# Altium schematic sheet Power Management.SchDoc
size A4; SheetNumber: 4; SheetTotal: 4
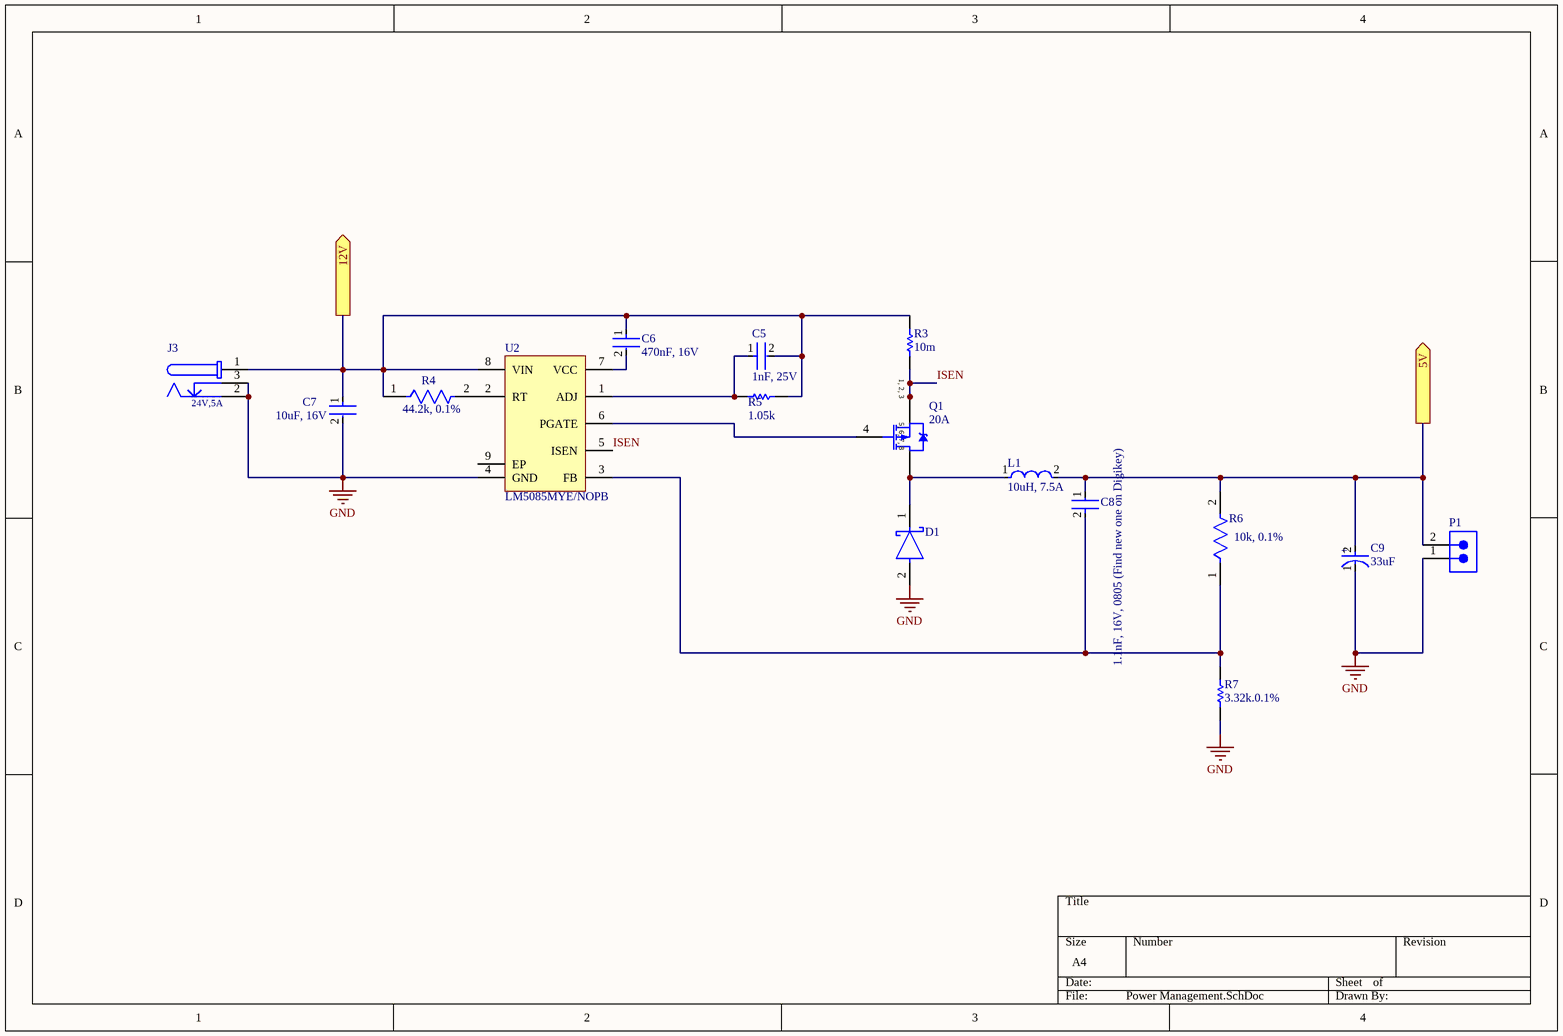
[diagram p0: Power Management.SchDoc]

## Parts
C5  1nF, 25V  [FP-C0805C-DN-MFG]
C6  470nF, 16V  [FP-0805-L_2_01_0_2-W_1_25-IPC_B]
C7  10uF, 16V  [FP-C2012-125-0_2-MFG]
C8  1.1nF, 16V, 0805 (Find new one on Digikey)  [FP-GRM216-0_1-MFG]
C9  33uF  [FP-TAJB-MFG]
D1  (no value)  [FP-95402-MFG]
J3  24V,5A  [694106301002]
L1  10uH, 7.5A  [FP-IHLP-4040DZ-FP_3_124x3-MFG]
P1  TSW-102-26-G-S  [SMTC-TSW-102-26-XX-S]  (value not drawn)
Q1  20A  [ONSC-SOIC-8-751-07_V]
R3  10m  [RESC2013X75X55NL20T20]
R4  44.2k, 0.1%  [FP-RT0805-MFG]
R5  1.05k  [RESC2013X70X40NL20T20]
R6  10k, 0.1%  [FP-MCU0805-IPC_C]
R7  3.32k.0.1%  [RESC2013X55X40NL15T20]
U2  LM5085MYE/NOPB  [DGN0008A_N]

## Ports
5V (out), 12V (out)

## Nets
GND: C7.2 C9.1(C) D1.2(A) J3.2 J3.3 P1.1 R7.1 U2.4(GND)
5V: C8.1 C9.2(A) L1.2 P1.2 R6.2 ; port 5V
12V: C5.2 C6.1 C7.1 J3.1 R3.2 R4.1 R5.2 U2.8(VIN) ; port 12V
ISEN: Q1.1(S) Q1.2(S) Q1.3(S) R3.1 U2.5(ISEN)
NetC5_1: C5.1 R5.1 U2.1(ADJ)
NetC6_2: C6.2 U2.7(VCC)
NetC8_2: C8.2 R6.1 R7.2 U2.3(FB)
NetD1_1: D1.1(C) L1.1 Q1.5(D) Q1.6(D) Q1.7(D) Q1.8(D)
NetQ1_4: Q1.4(G) U2.6(PGATE)
NetR4_2: R4.2 U2.2(RT)

Not connected (* = marked no-connect by the designer): U2 9(EP)

## Notes on the sheet
- (in symbol CMP-1058-00697-1) 1, 2, 3; 5, 6, 7, 8
- (in symbol CMP-04424-000306-1) +

## Library data of the parts
C5 = CMP-2007-01131-2: CAP CER 1000PF 25V X7R 0805; Manufacturer: KEMET; Manufacturer Part Number: C0805C102K3RACTU; Material: Ceramic; Description: C0805 1,000 pF X7R 30ppm/°C 10.00% 25 V; Tolerance: 0.1; Value: 1,000 pF; Temperature Coefficient: 30ppm/°C; RoHS: TRUE; Ipc Land Pattern Name: CAPC200125X78; Digikey Description: CAP CER 1000PF 25V X7R 0805; ComponentLink2URL: https://content.kemet.com/datasheets/KEM_C1003_C0G_SMD.pdf; Octopart: https://octopart.com/c0805c102k3ractu-kemet-16646211; Mouser Description: Cap Ceramic 0.001uF 25V X7R 10% SMD 0805 125°C Paper T/R; Temperature Range Low: -55°C; Temperature Characteristic: X7R; Package: C0805C-DN; ComponentLink2Description: Datasheet; Lead Free: Yes; Temperature Range High: +125°C; Voltage Rating: 25 V; Automotive: No; Height: 0.88mm; Capacitance: 1,000 pF; Device Class L3: Ceramic Capacitors; Device Class L1: Passive Components; Category: Cap; Device Class L2: Capacitors; Temperature: -55°C to +125°C
C6 = CMP-2007-04653-2: General Purpose Ceramic Capacitor, 0805, 470nF, 10%, X7R, 15%, 16V; Dissipation Factor: 3.5%; Insulation Resistance: 100GR; Thickness: 0.055inch; Max Operating Temperature: 125°C; Termination: SMD/SMT; Voltage: 16V; Dielectric: X7R; Lead Free: Lead Free; Construction: Flat; Case Code (Metric): 2012; Min Operating Temperature: -55°C; Size: 1.4mm; Case Code (Imperial): 0805; RoHS Compliant: Yes; Case/Package: 0805; Capacitance: 470nF; Tolerance: 10%; Number of Pins: 2; Voltage Rating (DC): 16V; Depth: 1.25mm; Width: 1.25mm; Contact Plating: Tin; Package Quantity: 1; Voltage Rating: 16V; Height: 1.4mm; Packaging: Tape and Reel; Length: 2.01mm; REACH SVHC: No SVHC; Mount: Surface Mount; Series: -; Radiation Hardening: No
C7 = CMP-08246-003655-1: Multilayer Ceramic Capacitors 10μF ±10% 16V X6S SMD 0805; Contact Plating: Tin; Height: 1.25mm; Thickness: 0.057inch; Case Code (Metric): 2012; Dielectric Material: Ceramic; Tolerance: 10%; Depth: 1.25mm; Length: 2mm; Lead Free: Lead Free; RoHS Compliant: Yes; Case/Package: 0805; REACH SVHC: No SVHC; Capacitance: 10uF; Construction: Flat; Voltage Rating: 16V; Max Operating Temperature: 105°C; Series: C; Width: 0.049inch; Voltage Rating (DC): 16V; Packaging: Tape and Reel; Package Quantity: 1; Min Operating Temperature: -55°C; Mount: Surface Mount; Dielectric: X6S; Case Code (Imperial): 0805
C8 = CMP-2007-00909-2: Chip Multilayer Ceramic Capacitors for General Purpose, 0805, 1100pF, C0G, 30ppm/°C, 5%, 100V; Case Code (Imperial): 0805; Tolerance: 5%; Weight: 0.000194oz; Voltage Rating (DC): 100V; Construction: Flat; Case Code (Metric): 2012; Max Operating Temperature: 125°C; Width: 0.049inch; Min Operating Temperature: -55°C; RoHS Compliant: Yes; Voltage Rating: 100V; Case/Package: 0805; Height: 0.6mm; Thickness: 0.028inch; Packaging: Tape and Reel; Series: GRM; Mount: Surface Mount; Capacitance: 1.1nF; Radiation Hardening: No; Termination: SMD/SMT; Length: 2mm; Package Quantity: 4000; Depth: 1.25mm; Dielectric: C0G
C9 = CMP-04424-000306-1: 33uF 6.3V  ±10% 2.2Ω 1210  SMD Tantalum Capacitor; Tolerance: 20%; ESR (Equivalent Series Resistance): 2.2R; Dissipation Factor: 6%; Leakage Current: 2.1uA; Polarity: Polar; Voltage: 10V; Lead Free: Lead Free; Min Operating Temperature: -55°C; REACH SVHC: No SVHC; Lead Pitch: 1.4mm; Features: General Purpose; Case Code (Imperial): 1210; Package Quantity: 1; Case/Package: 1210; Radiation Hardening: No; RoHS Compliant: Yes; Dielectric Material: Tantalum; Height - Seated (Max): 0.083inch; Length: 3.5mm; Mount: Surface Mount; Construction: Flat; Width: 2.8mm; Capacitance: 33uF; Case Code (Metric): 3528; Number of Pins: 2; Depth: 2.8mm; Series: TAJ; Voltage Rating (DC): 6.3V; Height: 1.9mm; Packaging: Tape and Reel; Voltage Rating: 6.3V; Max Operating Temperature: 125°C; Termination: SMD/SMT
D1 = CMP-02539-000012-1: DIODE SCHOTTKY 40V 3A DO214AB; Manufacturer: Vishay; Manufacturer Part Number: SS34-E3/57T; Description: Diode Schottky 40V 3A Surface Mount DO-214AB (SMC); Max Junction Temp: +150°C; Peak Reverse Current: 0.5mA; Max Surge Forward Current: 100A; Standoff Height: 0mm; ComponentLink2Description: Datasheet; Device Class L3: Schottky Diodes; Height: 2.62mm; Max Repetitive Reverse Voltage: 40V; Lead Free: Yes; Package: 95402; Temperature Range High: +150°C; ComponentLink2URL: http://www.vishay.com/docs/88751/ss32.pdf; Temperature: -55°C to +150°C; Footprint Url: http://www.vishay.com/docs/95402/smc.pdf; Automotive: No; Forward Current: 3A; Category: Diode; RoHS: TRUE; Device Class L2: Diodes; Mouser Description: Schottky Diodes & Rectifiers 3.0 Amp 40 Volt; Octopart: https://octopart.com/ss34-e3%2F57t-vishay-39552907; Temperature Range Low: -55°C; Device Class L1: Discrete Semiconductors; Digikey Description: DIODE SCHOTTKY 40V 3A DO214AB
J3 = CMP-1502-00188-1: DC Power Jack Connector WR-DC, Male, Right Angled, THT, 5 A, 24 V; Manufacturer: Wurth Elektronik; Plug Inner Diameter: 2.05mm; Opening Diameter: 6.4mm; Plug Outer Diameter: 5.5mm; Datasheet URL: http://katalog.we-online.de/em/datasheet/6941xx301002.pdf; Packaging: Bag; Manufacturer URL: http://www.we-online.de; Part Number: 694106301002; Rated Current: 5A; Gender: Male; Publisher: WurthElektronik; Operating Temperature: -40to85degC; Mounting Technology: THT; Package Reference: 694106301002; Working Voltage: 24V; Orientation: RightAngled
L1 = CMP-02424-000252-1: Commercial Inductors, Low DCR Series 10uH 7.5A 30.5mΩ 20%; DC Resistance (DCR): 30.5mR; Core Material: Metal; Test Frequency: 100kHz; Self Resonant Frequency: 1MHz; Saturation Current: 7.1A; Shielding: Shielded; Height - Seated (Max): 0.157inch; Height: 4mm; Number of Pins: 2; Current Rating: 7.5A; Packaging: Tape and Reel; Tolerance: 20%; Case/Package: 4040; Depth: 10.3mm; Radiation Hardening: No; Military Standard: Not; Min Operating Temperature: -55°C; Max Operating Temperature: 125°C; RMS Current (Irms): 7.5A; Mount: Surface Mount; Inductance: 10uH; Width: 10.3mm; Max DC Current: 7.1A; Termination: SMD/SMT; Package Quantity: 500; Contact Plating: Tin; Lead Free: Lead Free; Inductance Tolerance: 20%; Length: 10.92mm
P1 = CMP-1024-00327-1: 0.025" SQ Post Header, Through-hole, Vertical, -55 to 125 degC, 2.54 mm Pitch, 2-Pin, Male, RoHS; Manufacturer: Samtec; Pitch: 2.54 mm; Orientation: Vertical; ComponentLink3Description: Package Specification; PackageReference: TSW-102-26-XX-S; Mounting Technology: Through-hole; ComponentLink2Description: Datasheet; ComponentLink1URL: http://www.samtec.com; DatasheetVersion: F-214; ComponentLink1Description: Manufacturer URL; RoHS: True; ComponentLink2URL: http://www.samtec.com/documents/webfiles/pdf/TSW_TH.PDF; PartNumber: TSW-102-26-G-S; ComponentLink3URL: http://www.samtec.com/documents/webfiles/cpdf/TSW-XXX-XX-XXX-X-XX-XXX-MKT.pdf; PackageDescription: .025[0.64] SQ. Post Terminal Strip Assembly; PackageVersion: DM, 8/1988; Temperature Range: -55 to 125 degC
Q1 = CMP-1058-00697-1: Power MOSFET, -10 A, -20 V, Single P-Channel Enhancement-Mode, 8-Pin SOIC, Pb-Free, Tape and Reel; PartNumber: NTMS10P02R2G; Manufacturer: On Semiconductor; VGS Max (V): 12; Qrr Typ (nC): 75; V(BR)DSS Min (V): 20; Crss Typ (pF): 475; Ciss Typ (pF): 3100; Channel Polarity: P Channel; Coss Typ (pF): 1100; VGS(th) Max (V): 1.2; PackageReference: SOIC-8-751-07; Configuration: Single; ComponentLink1URL: http://www.onsemi.com/; RoHS: Pb-Free; PackageDescription: 8-Pin Small Outline Integrated Circuit, Body 4.9 x 3.9 mm, Pitch 1.27 mm; Mounting Technology: Surface Mount; Package Type: SOIC-8; ComponentLink2Description: Datasheet; Packing: Tape and Reel; ComponentLink3URL: http://www.onsemi.com/pub_link/Collateral/751-07.PDF; ComponentLink3Description: Package Specification; DatasheetVersion: Rev. 3; ComponentLink1Description: Manufacturer URL; ComponentLink2URL: http://www.onsemi.cn/pub_link/Collateral/NTMS10P02R2-D.PDF; PackageVersion: Rev. AK, 02/2011
R3 = CMP-2001-04363-1: Part Number: ERJ-6BWFR010V; Manufacturer: Panasonic
R4 = CMP-03412-006606-1: RES SMD 44.2K OHM 0.1% 1/8W 0805; Manufacturer Part Number: RT0805BRD0744K2L; Manufacturer: Yageo; Description: RT0805 44.2KΩ 0.125W 25 ppm/°C 0.25%; Temperature Coefficient: 25 ppm/°C; Voltage Rating: 150V; Resistance: 44.2KΩ; Power Rating: 0.125W; Tolerance: 0.0025; Value: 44.2KΩ; Footprint Url: http://www.yageo.com/exep/pages/download/literatures/PYu-R_Mount_10.pdf; Composition: Thin Film; Octopart: https://octopart.com/rt0805brd0744k2l-yageo-1480106; Series: RT; ComponentLink2Description: Datasheet; Automotive: No; Temperature: -55°C to +155°C; Device Class L2: Resistors; Package: RT0805; Height: 0.6mm; Ipc Land Pattern Name: RESC200125X50; Digikey Description: RES SMD 44.2K OHM 0.1% 1/8W 0805; Lead Free: Yes; Mouser Description: Thin Film Resistors - SMD 1/8W 44.2K ohm .1% 25ppm; ComponentLink2URL: http://www.yageo.com/documents/recent/PYu-RT_1-to-0.01_RoHS_L_9.pdf; RoHS: TRUE; Device Class L3: Chip SMD Resistors; Temperature Range Low: -55°C; Device Class L1: Passive Components; Category: Res; Temperature Range High: +155°C
R5 = CMP-2001-04384-1: Manufacturer: Panasonic; Part Number: ERJ-6ENF1051V
R6 = CMP-02407-001182-1: RES 1.05K OHM 0.5% 1/5W 0805; Voltage Rating (DC): 150V; Resistance: 10kR; Power Rating: 50mW; Temperature Coefficient: 25ppm/°C; Packaging: Tape and Reel; Contact Plating: Tin; Case Code (Imperial): 0805; Mount: Surface Mount; Width: 1.25mm; Lead Free: Lead Free; Case/Package: 0805; Length: 2mm; Voltage Rating: 150V; Composition: Thin Film; REACH SVHC: No SVHC; Military Standard: Not; Max Operating Temperature: 125°C; Depth: 1.25mm; Tolerance: 0.1%; Min Operating Temperature: -55°C; Case Code (Metric): 2012; Radiation Hardening: No
R7 = CMP-2001-04771-1: Part Number: TNPW08053K32BEEN; Manufacturer: Vishay Dale
U2 = CMP-0069-01300-3: 75V Constant On-Time PFET Buck Switching Controller, 8-pin eMSOP, Pb-Free; Manufacturer: Texas Instruments; PowerWise: Y; PackageTopMarking: ZXTT*SSSB; CompType: Switcher; ComponentLink1URL: http://www.ti.com/general/docs/lit/getliterature.tsp?genericPartNumber=LM5085&fileType=pdf; Code_JEDEC: MO-187-AA; PackageDescription: Molded Mini-SO, Exposed Pad, .118 x .118 x .034in Body, 8 Lead, .0256in Pitch; RoHS: Y; PackageReference: DGN0008A; PinCount: 8; ComponentLink1Description: Datasheet URL